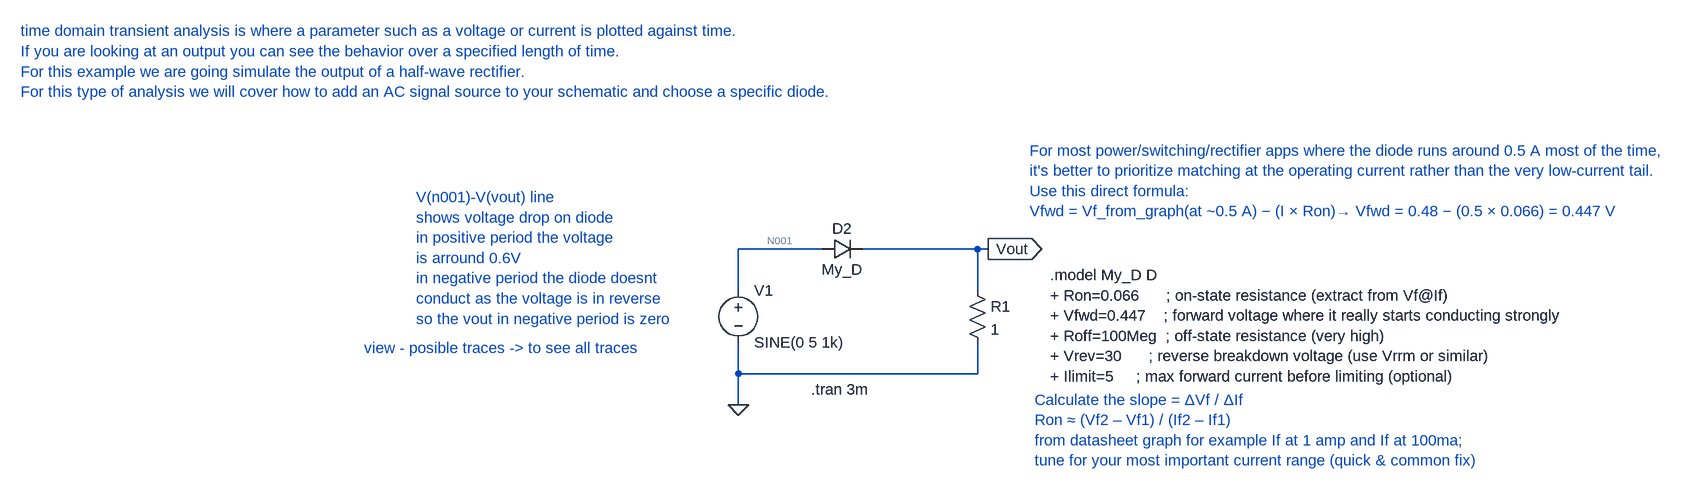
[diagram p0: schematic transient_analysis.asc]
transient_analysis.asc, the LTspice schematic file:
Version 4
SHEET 1 1684 680
WIRE -32 32 -160 32
WIRE 208 32 32 32
WIRE 224 32 208 32
WIRE -160 96 -160 32
WIRE 208 96 208 32
WIRE -160 224 -160 176
WIRE 208 224 208 176
WIRE 208 224 -160 224
WIRE -160 272 -160 224
FLAG -160 272 0
FLAG 224 32 Vout
IOPIN 224 32 Out
SYMBOL res 192 80 R0
SYMATTR InstName R1
SYMATTR Value 1
SYMBOL voltage -160 80 R0
WINDOW 123 0 0 Left 0
WINDOW 39 0 0 Left 0
SYMATTR InstName V1
SYMATTR Value SINE(0 5 1k)
SYMBOL diode -32 48 R270
WINDOW 0 32 32 VTop 2
WINDOW 3 0 32 VBottom 2
SYMATTR InstName D2
SYMATTR Value My_D
TEXT -48 248 Left 2 !.tran 3m
TEXT -656 -48 Left 2 ;V(n001)-V(vout) line\nshows voltage drop on diode\nin positive period the voltage\nis arround 0.6V\nin negative period the diode doesnt\nconduct as the voltage is in reverse\nso the vout in negative period is zero
TEXT -736 184 Left 2 ;view - posible traces -> to see all traces
TEXT -1264 -304 Left 2 ;time domain transient analysis is where a parameter such as a voltage or current is plotted against time.\nIf you are looking at an output you can see the behavior over a specified length of time.\nFor this example we are going simulate the output of a half-wave rectifier.\nFor this type of analysis we will cover how to add an AC signal source to your schematic and choose a specific diode.
TEXT 320 72 Left 2 !.model My_D D\n+ Ron=0.066      ; on-state resistance (extract from Vf@If)\n+ Vfwd=0.447    ; forward voltage where it really starts conducting strongly\n+ Roff=100Meg  ; off-state resistance (very high)\n+ Vrev=30      ; reverse breakdown voltage (use Vrrm or similar)\n+ Ilimit=5     ; max forward current before limiting (optional)
TEXT 288 -120 Left 2 ;For most power/switching/rectifier apps where the diode runs around 0.5 A most of the time,\nit's better to prioritize matching at the operating current rather than the very low-current tail.\nUse this direct formula:\nVfwd = Vf_from_graph(at ~0.5 A) − (I × Ron)→ Vfwd = 0.48 − (0.5 × 0.066) = 0.447 V
TEXT 296 264 Left 2 ;Calculate the slope = ΔVf / ΔIf\nRon ≈ (Vf2 – Vf1) / (If2 – If1)\nfrom datasheet graph for example If at 1 amp and If at 100ma;\ntune for your most important current range (quick & common fix)

The netlist it stands for:
* transient_analysis.asc
R1 Vout 0 1
V1 N001 0 SINE(0 5 1k)
D2 N001 Vout My_D
.model D D
.lib standard.dio
.tran 3m
* V(n001)-V(vout) line
* shows voltage drop on diode
* in positive period the voltage
* is arround 0.6V
* in negative period the diode doesnt
* conduct as the voltage is in reverse
* so the vout in negative period is zero
* view - posible traces -> to see all traces
* time domain transient analysis is where a parameter such as a voltage or current is plotted against time.
* If you are looking at an output you can see the behavior over a specified length of time.
* For this example we are going simulate the output of a half-wave rectifier.
* For this type of analysis we will cover how to add an AC signal source to your schematic and choose a specific diode.
.model My_D D
+ Ron=0.066      ; on-state resistance (extract from Vf@If)
+ Vfwd=0.447    ; forward voltage where it really starts conducting strongly
+ Roff=100Meg  ; off-state resistance (very high)
+ Vrev=30      ; reverse breakdown voltage (use Vrrm or similar)
+ Ilimit=5     ; max forward current before limiting (optional)
* For most power/switching/rectifier apps where the diode runs around 0.5 A most of the time,
* it's better to prioritize matching at the operating current rather than the very low-current tail.
* Use this direct formula:
* Vfwd = Vf_from_graph(at ~0.5 A) − (I × Ron)→ Vfwd = 0.48 − (0.5 × 0.066) = 0.447 V
* Calculate the slope = ΔVf / ΔIf
* Ron ≈ (Vf2 – Vf1) / (If2 – If1)
* from datasheet graph for example If at 1 amp and If at 100ma;
* tune for your most important current range (quick & common fix)
.backanno
.end

* Results of the author's LTspice run, read from the files saved beside the schematic
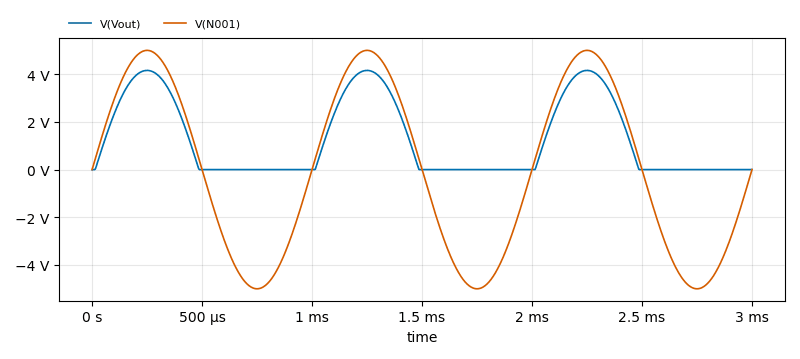
[diagram p1: Transient Analysis of transient_analysis.asc, plotted from the saved traces]
* Transient Analysis, 1 run:
*   V(Vout): min 0 V, max 4.159 V, average 1.269 V, rms 2.045 V, last 0 V
*   V(N001): min -5 V, max 5 V, average 0 V, rms 3.536 V, last 0 V